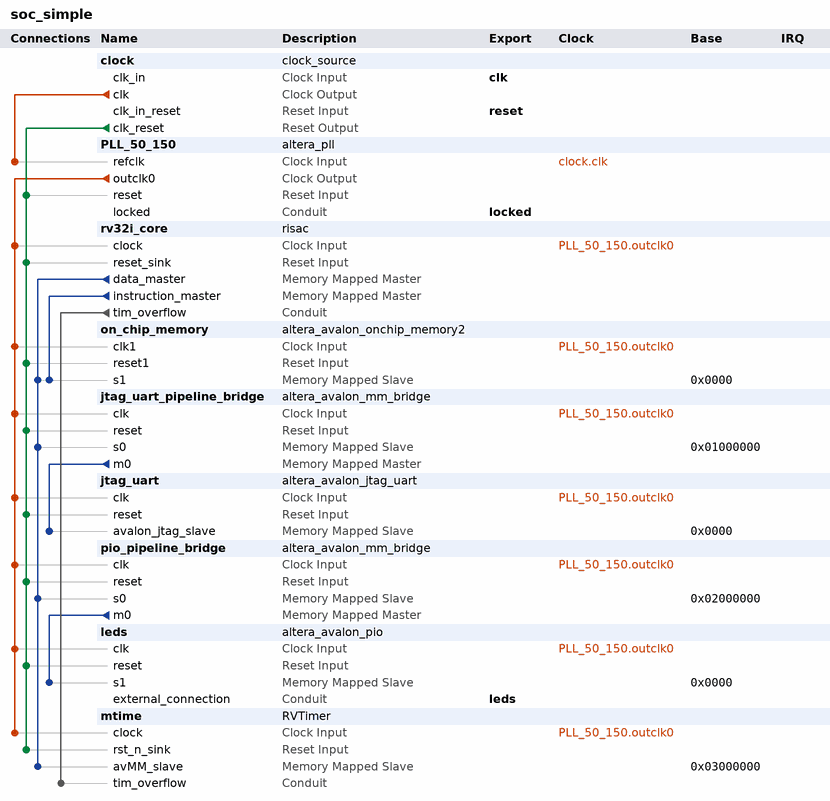
[diagram p0: system contents]
# Platform Designer (Qsys) system soc_simple, Cyclone V 5CSEBA6U23I7
# Parameters at their usual value, and those the tool derives, are not listed.
package require -exact qsys 16.0
create_system soc_simple
set_project_property DEVICE_FAMILY {Cyclone V}
set_project_property DEVICE 5CSEBA6U23I7

add_instance clock clock_source 16.0
set_instance_parameter_value clock clockFrequency 50000000

add_instance PLL_50_150 altera_pll 16.0
set_instance_parameter_value PLL_50_150 gui_device_speed_grade 2
set_instance_parameter_value PLL_50_150 gui_number_of_clocks 1
set_instance_parameter_value PLL_50_150 gui_operation_mode direct
set_instance_parameter_value PLL_50_150 gui_output_clock_frequency0 120.0
set_instance_parameter_value PLL_50_150 gui_pll_mode {Integer-N PLL}
set_instance_parameter_value PLL_50_150 gui_reference_clock_frequency 50.0
set_instance_parameter_value PLL_50_150 gui_use_locked true

add_instance rv32i_core risac 1.0

add_instance on_chip_memory altera_avalon_onchip_memory2 16.0
set_instance_parameter_value on_chip_memory dataWidth 32
set_instance_parameter_value on_chip_memory dualPort false
set_instance_parameter_value on_chip_memory initMemContent true
set_instance_parameter_value on_chip_memory initializationFileName hex/program.mif
set_instance_parameter_value on_chip_memory instanceID MEM
set_instance_parameter_value on_chip_memory memorySize 131072
set_instance_parameter_value on_chip_memory useNonDefaultInitFile true

add_instance jtag_uart_pipeline_bridge altera_avalon_mm_bridge 16.0
set_instance_parameter_value jtag_uart_pipeline_bridge ADDRESS_UNITS SYMBOLS
set_instance_parameter_value jtag_uart_pipeline_bridge ADDRESS_WIDTH 10
set_instance_parameter_value jtag_uart_pipeline_bridge DATA_WIDTH 32
set_instance_parameter_value jtag_uart_pipeline_bridge MAX_PENDING_RESPONSES 4
set_instance_parameter_value jtag_uart_pipeline_bridge USE_AUTO_ADDRESS_WIDTH 1

add_instance jtag_uart altera_avalon_jtag_uart 16.0
set_instance_parameter_value jtag_uart simInteractiveOptions NO_INTERACTIVE_WINDOWS

add_instance pio_pipeline_bridge altera_avalon_mm_bridge 16.0
set_instance_parameter_value pio_pipeline_bridge ADDRESS_UNITS SYMBOLS
set_instance_parameter_value pio_pipeline_bridge ADDRESS_WIDTH 10
set_instance_parameter_value pio_pipeline_bridge DATA_WIDTH 32
set_instance_parameter_value pio_pipeline_bridge MAX_PENDING_RESPONSES 4
set_instance_parameter_value pio_pipeline_bridge USE_AUTO_ADDRESS_WIDTH 1

add_instance leds altera_avalon_pio 16.0
set_instance_parameter_value leds direction Output
set_instance_parameter_value leds width 8

add_instance mtime RVTimer 1.0

# connections
add_connection clock.clk PLL_50_150.refclk clock
add_connection PLL_50_150.outclk0 jtag_uart.clk clock
add_connection PLL_50_150.outclk0 jtag_uart_pipeline_bridge.clk clock
add_connection PLL_50_150.outclk0 leds.clk clock
add_connection PLL_50_150.outclk0 mtime.clock clock
add_connection PLL_50_150.outclk0 on_chip_memory.clk1 clock
add_connection PLL_50_150.outclk0 pio_pipeline_bridge.clk clock
add_connection PLL_50_150.outclk0 rv32i_core.clock clock
add_connection clock.clk_reset jtag_uart.reset reset
add_connection clock.clk_reset jtag_uart_pipeline_bridge.reset reset
add_connection clock.clk_reset leds.reset reset
add_connection clock.clk_reset mtime.rst_n_sink reset
add_connection clock.clk_reset on_chip_memory.reset1 reset
add_connection clock.clk_reset pio_pipeline_bridge.reset reset
add_connection clock.clk_reset PLL_50_150.reset reset
add_connection clock.clk_reset rv32i_core.reset_sink reset
add_connection jtag_uart_pipeline_bridge.m0 jtag_uart.avalon_jtag_slave avalon
set_connection_parameter_value jtag_uart_pipeline_bridge.m0/jtag_uart.avalon_jtag_slave baseAddress 0x0000
add_connection pio_pipeline_bridge.m0 leds.s1 avalon
set_connection_parameter_value pio_pipeline_bridge.m0/leds.s1 baseAddress 0x0000
add_connection rv32i_core.data_master jtag_uart_pipeline_bridge.s0 avalon
set_connection_parameter_value rv32i_core.data_master/jtag_uart_pipeline_bridge.s0 baseAddress 0x01000000
add_connection rv32i_core.data_master mtime.avMM_slave avalon
set_connection_parameter_value rv32i_core.data_master/mtime.avMM_slave baseAddress 0x03000000
add_connection rv32i_core.data_master on_chip_memory.s1 avalon
set_connection_parameter_value rv32i_core.data_master/on_chip_memory.s1 baseAddress 0x0000
add_connection rv32i_core.data_master pio_pipeline_bridge.s0 avalon
set_connection_parameter_value rv32i_core.data_master/pio_pipeline_bridge.s0 baseAddress 0x02000000
add_connection rv32i_core.instruction_master on_chip_memory.s1 avalon
set_connection_parameter_value rv32i_core.instruction_master/on_chip_memory.s1 baseAddress 0x0000
add_connection rv32i_core.tim_overflow mtime.tim_overflow conduit

# exported interfaces
add_interface clk clock sink
set_interface_property clk EXPORT_OF clock.clk_in
add_interface leds conduit end
set_interface_property leds EXPORT_OF leds.external_connection
add_interface locked conduit end
set_interface_property locked EXPORT_OF PLL_50_150.locked
add_interface reset reset sink
set_interface_property reset EXPORT_OF clock.clk_in_reset

set_interconnect_requirement {$system} qsys_mm.clockCrossingAdapter HANDSHAKE
set_interconnect_requirement {$system} qsys_mm.enableEccProtection FALSE
set_interconnect_requirement {$system} qsys_mm.insertDefaultSlave FALSE
set_interconnect_requirement {$system} qsys_mm.maxAdditionalLatency 2

save_system soc_simple.qsys
